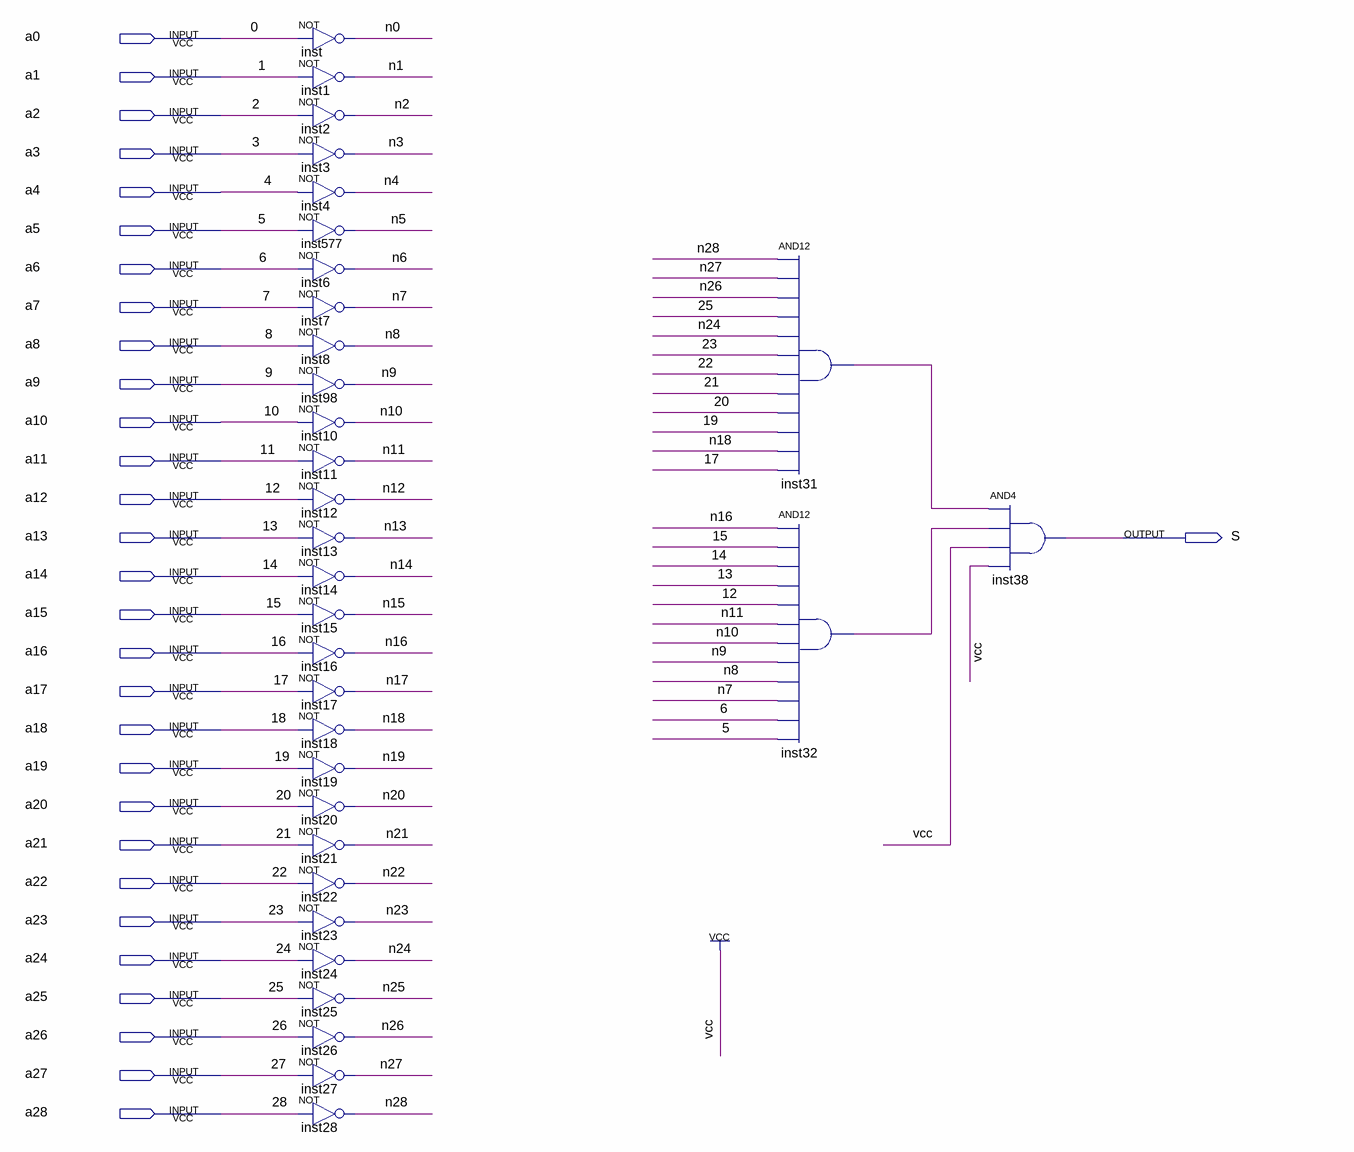
[diagram p0: schematic sheet]
// Quartus schematic Decodificador_frequencia_simples.bdf as structural Verilog: 32 symbols, 30 pins
module Decodificador_frequencia_simples (
  input  a0,
  input  a1,
  input  a2,
  input  a3,
  input  a4,
  input  a5,
  input  a6,
  input  a7,
  input  a8,
  input  a9,
  input  a10,
  input  a11,
  input  a12,
  input  a13,
  input  a14,
  input  a15,
  input  a16,
  input  a17,
  input  a18,
  input  a19,
  input  a20,
  input  a21,
  input  a22,
  input  a23,
  input  a24,
  input  a25,
  input  a26,
  input  a27,
  input  a28,
  output S
);

  wire inst31_out, inst32_out, n0, n1, n2, n3, n4, n5, n6, n7, n8, n9, n10, n11, n12, n13, n14, n15, n16,
       n17, n18, n19, n20, n21, n22, n23, n24, n25, n26, n27, n28;

  not inst (n0, a0);
  not inst1 (n1, a1);
  not inst2 (n2, a2);
  not inst3 (n3, a3);
  not inst4 (n4, a4);
  not inst577 (n5, a5);
  not inst6 (n6, a6);
  not inst7 (n7, a7);
  not inst8 (n8, a8);
  not inst98 (n9, a9);
  not inst10 (n10, a10);
  not inst11 (n11, a11);
  not inst12 (n12, a12);
  not inst13 (n13, a13);
  not inst14 (n14, a14);
  not inst15 (n15, a15);
  not inst16 (n16, a16);
  not inst17 (n17, a17);
  not inst18 (n18, a18);
  not inst19 (n19, a19);
  not inst20 (n20, a20);
  not inst21 (n21, a21);
  not inst22 (n22, a22);
  not inst23 (n23, a23);
  not inst24 (n24, a24);
  not inst25 (n25, a25);
  not inst26 (n26, a26);
  not inst27 (n27, a27);
  not inst28 (n28, a28);
  and inst31 (inst31_out, n28, n27, n26, a25, n24, a23, a22, a21, a20, a19, n18, a17);
  and inst32 (inst32_out, n16, a15, a14, a13, a12, n11, n10, n9, n8, n7, a6, a5);
  and inst38 (S, inst31_out, inst32_out, 1'b1, 1'b1);

  // Other names for the same wires on the sheet: 0 = a0; 1 = a1; 2 = a2; 3 = a3; 4 = a4; 5 = a5; 6 = a6; 7 = a7;
  //   8 = a8; 9 = a9; 10 = a10; 11 = a11; 12 = a12; 13 = a13; 14 = a14; 15 = a15; 16 = a16; 17 = a17; 18 = a18;
  //   19 = a19; 20 = a20; 21 = a21; 22 = a22; 23 = a23; 24 = a24; 25 = a25; 26 = a26; 27 = a27; 28 = a28
endmodule
